# EAGLE design ccr_v10 (EAGLE 6.1)
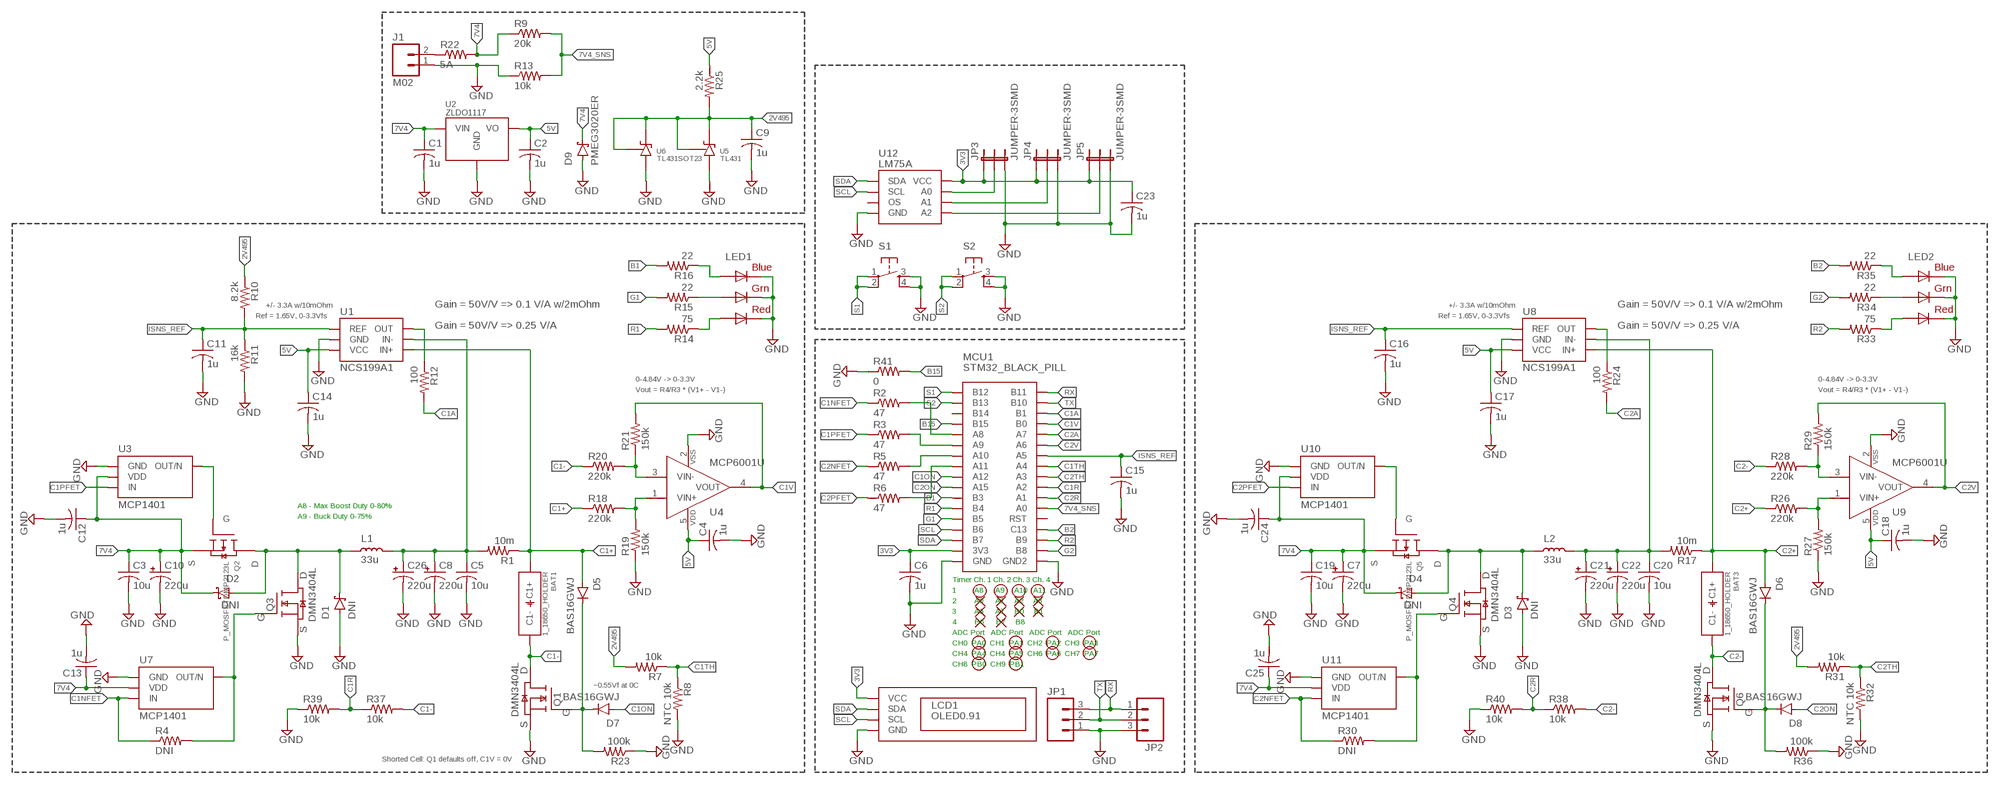
[diagram p0: schematic, sheet 1]

## Parts
BAT1  1_18650_HOLDER  [1S_18650_SMD_NH]
BAT3  1_18650_HOLDER  [1S_18650_SMD_NH]
C1  1u  C-USC0402  [C0402]
C2  1u  C-USC0402  [C0402]
C3  10u  C-USC1206  [C1206]
C4  1u  C-USC0402  [C0402]
C5  10u  C-USC1206  [C1206]
C6  1u  C-USC0402  [C0402]
C7  220u  CPOL-USD  [PANASONIC_D]
C8  220u  CPOL-USD  [PANASONIC_D]
C9  1u  C-USC0402  [C0402]
C10  220u  CPOL-USD  [PANASONIC_D]
C11  1u  C-USC0402  [C0402]
C12  1u  C-USC0402  [C0402]
C13  1u  C-USC0402  [C0402]
C14  1u  C-USC0402  [C0402]
C15  1u  C-USC0402  [C0402]
C16  1u  C-USC0402  [C0402]
C17  1u  C-USC0402  [C0402]
C18  1u  C-USC0402  [C0402]
C19  10u  C-USC1206  [C1206]
C20  10u  C-USC1206  [C1206]
C21  220u  CPOL-USD  [PANASONIC_D]
C22  220u  CPOL-USD  [PANASONIC_D]
C23  1u  C-USC0402  [C0402]
C24  1u  C-USC0402  [C0402]
C25  1u  C-USC0402  [C0402]
C26  220u  CPOL-USD  [PANASONIC_D]
D1  DNI  PMEG3020ER  [SOD123W]
D2  DNI  PMEG3020ER  [SOD123W]
D3  DNI  PMEG3020ER  [SOD123W]
D4  DNI  PMEG3020ER  [SOD123W]
D5  BAS16GWJ  BAT60A  [SOD323]
D6  BAS16GWJ  BAT60A  [SOD323]
D7  BAS16GWJ  BAT60A  [SOD323]
D8  BAS16GWJ  BAT60A  [SOD323]
D9  PMEG3020ER  [SOD123W]
J1  M02  [PHOENIXCONTACT1935161]
JP1  M03PTH  [1X03]
JP2  M03PTH  [1X03]
JP3  JUMPER-3SMD  [SJ_3]
JP4  JUMPER-3SMD  [SJ_3]
JP5  JUMPER-3SMD  [SJ_3]
L1  33u  SDR1307  [INDUCTOR_SMD_13MM]
L2  33u  SDR1307  [INDUCTOR_SMD_13MM]
LCD1  OLED0.91  [OLED0.91]
LED1  RGBLED5050  [RGBLED5050]
LED2  RGBLED5050  [RGBLED5050]
MCU1  STM32_BLACK_PILL  [STM32_BLACK_PILL_BOT]
Q1  DMN3404L  [SOT23]
Q2  P_MOSFETDMP2123L  [SOT23]
Q3  DMN3404L  [SOT23]
Q4  DMN3404L  [SOT23]
Q5  P_MOSFETDMP2123L  [SOT23]
Q6  DMN3404L  [SOT23]
R1  10m  R-US_R2512  [R2512]
R2  47  R-US_R0402  [R0402]
R3  47  R-US_R0402  [R0402]
R4  DNI  R-US_R0402  [R0402]
R5  47  R-US_R0402  [R0402]
R6  47  R-US_R0402  [R0402]
R7  10k  R-US_R0402  [R0402]
R8  NTC 10k  R-US_R0402  [R0402]
R9  20k  R-US_R0402  [R0402]
R10  8.2k  R-US_R0402  [R0402]
R11  16k  R-US_R0402  [R0402]
R12  100  R-US_R0402  [R0402]
R13  10k  R-US_R0402  [R0402]
R14  75  R-US_R0402  [R0402]
R15  22  R-US_R0402  [R0402]
R16  22  R-US_R0402  [R0402]
R17  10m  R-US_R2512  [R2512]
R18  220k  R-US_R0402  [R0402]
R19  150k  R-US_R0402  [R0402]
R20  220k  R-US_R0402  [R0402]
R21  150k  R-US_R0402  [R0402]
R22  5A  R-US_R1206  [R1206]
R23  100k  R-US_R0402  [R0402]
R24  100  R-US_R0402  [R0402]
R25  2.2k  R-US_R0402  [R0402]
R26  220k  R-US_R0402  [R0402]
R27  150k  R-US_R0402  [R0402]
R28  220k  R-US_R0402  [R0402]
R29  150k  R-US_R0402  [R0402]
R30  DNI  R-US_R0402  [R0402]
R31  10k  R-US_R0402  [R0402]
R32  NTC 10k  R-US_R0402  [R0402]
R33  75  R-US_R0402  [R0402]
R34  22  R-US_R0402  [R0402]
R35  22  R-US_R0402  [R0402]
R36  100k  R-US_R0402  [R0402]
R37  10k  R-US_R0402  [R0402]
R38  10k  R-US_R0402  [R0402]
R39  10k  R-US_R0402  [R0402]
R40  10k  R-US_R0402  [R0402]
R41  0  R-US_R0402  [R0402]
S1  TAC_SWITCHSMD  [TACTILE_SWITCH_SMD]
S2  TAC_SWITCHSMD  [TACTILE_SWITCH_SMD]
U1  NCS199A1  INA214  [SOT-363]
U2  ZLDO1117  [TO-261]
U3  MCP1401  [SOT23-5]
U4  MCP6001U  [SOT23-5]
U5  TL431  [SOT23-5]
U6  TL431SOT23  [SOT23]
U7  MCP1401  [SOT23-5]
U8  NCS199A1  INA214  [SOT-363]
U9  MCP6001U  [SOT23-5]
U10  MCP1401  [SOT23-5]
U11  MCP1401  [SOT23-5]
U12  LM75A  [8-SOIC]

## Nets
2V495: C9.1 R7.2 R10.1 R25.2 R31.2 U5.3(K) U5.4(REF) U6.1(K) U6.2(REF)
3V3: C6.1 C23.1 JP3.1 JP4.1 JP5.1 LCD1.2-VCC(VCC) MCU1.3V3 U12.8(VCC)
5V: C2.1 C4.1 C14.1 C17.1 C18.1 R25.1 U1.3(VCC) U2.2(VO) U2.4(VO) U4.5(VDD) U8.3(VCC) U9.5(VDD)
7V4: C1.1 C3.1 C7.+ C10.+ C12.1 C13.1 C19.1 C24.1 C25.1 D2.K(CATHODE) D4.K(CATHODE) D9.K(CATHODE) Q2.2(S) Q5.2(S) R9.1 R22.2 U2.3(VIN) U3.2(VDD) U7.2(VDD) U10.2(VDD) U11.2(VDD)
7V4_SNS: MCU1.A0 R9.2 R13.2
B1: MCU1.B3 R16.2
B2: MCU1.C13 R35.2
B15: MCU1.B15 R41.2
C1+: BAT1.1+(C1+) D5.A(ANODE) R1.1 R18.1 U1.4(IN+)
C1-: BAT1.1-(C1-) Q1.3(D) R20.1 R37.2
C1A: MCU1.B1 R12.2
C1NFET: R2.1 R4.1 U7.3(IN)
C1ON: D7.A(ANODE) MCU1.A12
C1PFET: R3.1 U3.3(IN)
C1R: MCU1.A2 R37.1 R39.2
C1TH: MCU1.A4 R7.1 R8.1
C1V: MCU1.B0 R21.2 U4.4(VOUT)
C2+: BAT3.1+(C1+) D6.A(ANODE) R17.1 R26.1 U8.4(IN+)
C2-: BAT3.1-(C1-) Q6.3(D) R28.1 R38.2
C2A: MCU1.A7 R24.2
C2NFET: R5.1 R30.1 U11.3(IN)
C2ON: D8.A(ANODE) MCU1.A15
C2PFET: R6.1 U10.3(IN)
C2R: MCU1.A1 R38.1 R40.2
C2TH: MCU1.A3 R31.1 R32.1
C2V: MCU1.A6 R29.2 U9.4(VOUT)
G1: MCU1.B5 R15.2
G2: MCU1.B8 R34.2
GND: C1.2 C2.2 C3.2 C4.2 C5.2 C6.2 C7.- C8.- C9.2 C10.- C11.2 C12.2 C13.2 C14.2 C15.2 C16.2 C17.2 C18.2 C19.2 C20.2 C21.- C22.- C23.2 C24.2 C25.2 C26.- D1.A(ANODE) D3.A(ANODE) D9.A(ANODE) J1.1 JP1.1 JP2.3 JP3.3 JP4.3 JP5.3 LCD1.1=GND(GND) LED1.4(BLUE_C) LED1.5(RED_C) LED1.6(GREEN_C) LED2.4(BLUE_C) LED2.5(RED_C) LED2.6(GREEN_C) MCU1.GND1(GND) MCU1.GND2 Q1.2(S) Q3.2(S) Q4.2(S) Q6.2(S) R8.2 R11.2 R13.1 R19.1 R23.1 R27.1 R32.2 R36.1 R39.1 R40.1 R41.1 S1.3 S1.4 S2.3 S2.4 U1.2(GND) U2.1(GND) U3.1(GND) U3.4(GND) U4.2(VSS) U5.2(A) U5.5(A) U6.3(A) U7.1(GND) U7.4(GND) U8.2(GND) U9.2(VSS) U10.1(GND) U10.4(GND) U11.1(GND) U11.4(GND) U12.4(GND)
I1-: C5.1 C8.+ C26.+ L1.2 R1.2 U1.5(IN-)
I1-1: C20.1 C21.+ C22.+ L2.2 R17.2 U8.5(IN-)
IS1O: R12.1 U1.6(OUT)
IS1O1: R24.1 U8.6(OUT)
ISNS_REF: C11.1 C15.1 C16.1 MCU1.A5 R10.2 R11.1 U1.1(REF) U8.1(REF)
N$1: MCU1.A8 R2.2
N$2: MCU1.A9 R3.2
N$3: R18.2 R19.2 U4.1(VIN+)
N$4: R20.2 R21.1 U4.3(VIN-)
N$5: Q2.1(G) U3.5(OUT/N)
N$6: D1.K(CATHODE) D2.A(ANODE) L1.1 Q2.3(D) Q3.3(D)
N$7: Q3.1(G) R4.2 U7.5(OUT/N)
N$8: MCU1.A10 R5.2
N$9: MCU1.A11 R6.2
N$10: LED1.3(BLUE_A) R16.1
N$11: LED1.1(GREEN_A) R15.1
N$12: LED1.2(RED_A) R14.1
N$13: J1.2 R22.1
N$14: D5.K(CATHODE) D7.K(CATHODE) Q1.1(G) R23.2
N$15: D6.K(CATHODE) D8.K(CATHODE) Q6.1(G) R36.2
N$16: R26.2 R27.2 U9.1(VIN+)
N$17: R28.2 R29.1 U9.3(VIN-)
N$18: D3.K(CATHODE) D4.A(ANODE) L2.1 Q4.3(D) Q5.3(D)
N$19: Q5.1(G) U10.5(OUT/N)
N$20: Q4.1(G) R30.2 U11.5(OUT/N)
N$21: LED2.3(BLUE_A) R35.1
N$22: LED2.1(GREEN_A) R34.1
N$23: LED2.2(RED_A) R33.1
N$27: JP3.2 U12.7(A0)
N$28: JP4.2 U12.6(A1)
N$29: JP5.2 U12.5(A2)
R1: MCU1.B4 R14.2
R2: MCU1.B9 R33.2
RX: JP1.3 JP2.1 MCU1.B11
S1: MCU1.B12 S1.1 S1.2
S2: MCU1.B13 S2.1 S2.2
SCL: LCD1.3=SCL(SCL) MCU1.B6 U12.2(SCL)
SDA: LCD1.4-SDA(SDA) MCU1.B7 U12.1(SDA)
TX: JP1.2 JP2.2 MCU1.B10
Unconnected: MCU1.B14 MCU1.RST U12.3(OS)

## Notes on the sheet
- +/- 3.3A w/10mOhm | Gain = 50V/V => 0.1 V/A w/2mOhm | +/- 3.3A w/10mOhm | Gain = 50V/V => 0.1 V/A w/2mOhm
- Ref = 1.65V, 0-3.3Vfs | Ref = 1.65V, 0-3.3Vfs
- Gain = 50V/V => 0.25 V/A | Gain = 50V/V => 0.25 V/A
- 0-4.84V -> 0-3.3V | 0-4.84V -> 0-3.3V
- Vout = R4/R3 * (V1+ - V1-) | Vout = R4/R3 * (V1+ - V1-)
- A8 - Max Boost Duty 0-80%
- A9 - Buck Duty 0-75%
- Timer Ch. 1 Ch. 2 Ch. 3 Ch. 4
- 1         A8      A9     A10   A11
- 2         A0      A1     A2     A3
- 3         A6      A7     B0     B1
- 4         B6      B7     B8
- ADC Port   ADC Port   ADC Port   ADC Port
- CH0  PA0  CH1  PA1  CH2  PA2  CH3  PA3
- CH4  PA4  CH4  PA5  CH6  PA6  CH7  PA7
- CH8  PB0  CH9  PB1
- ~0.55Vf at 0C
- Shorted Cell: Q1 defaults off, C1V = 0V

## Library data of the parts
BAT1 BAT3 = custom:1_18650_HOLDER
C1-C6 C9 C11-C20 C23-C25 = resistor:C-US: CAPACITOR, American symbol
C7 C8 C10 C21 C22 C26 = resistor:CPOL-US: POLARIZED CAPACITOR, American symbol
D1-D4 D9 = custom:PMEG3020ER: Schottky Diode 30V 2A 0.42V 1.5mA Leakage
D5-D8 = custom:BAT60A: Schottky Diode 10V 3A 0.37V at 1A
J1 = custom:M02
JP1 JP2 = SparkFun:M03: Header 3 Standard 3-pin 0.1" header. Use with straight break away headers (SKU : PRT-00116), right angle break away headers (PRT-00553), swiss pins (PRT-00743), machine pins (PRT-00117), and female headers (PRT-00115). Molex polarized connector foot print use with SKU : PRT-08232 with associated crimp pins and housings.
JP3-JP5 = SparkFun:JUMPER-3
L1 L2 = custom:SDR1307
LCD1 = custom:OLED0.91
LED1 LED2 = adafruit:RGBLED: For 5050 RGB LEDs, the order of the LEDs may vary from one manufacturer to another!
MCU1 = custom:STM32_BLACK_PILL
Q1 Q3 Q4 Q6 = custom:DMN3404L: N-Channel MOSFET 30V 5.8A 28mOhm Logic Level
Q2 Q5 = custom:P_MOSFET
R1-R41 = resistor:R-US_: RESISTOR, American symbol
S1 S2 = SparkFun:TAC_SWITCH: Momentary Switch Button commonly used for reset or general input. Spark Fun Electronics SKU : COM-00097
U1 U8 = custom:INA214: Current Shunt Amplifier 30kHz 2.7-26V
U2 = custom:ZLDO1117: Linear Regulator 18V Max 1A 10mA
U3 U7 U10 U11 = custom:MCP1401: 500mA MOSFET gate driver 4.5-18V, 3V input. 1402 = Non-inverting, 1401 = Inverting
U4 U9 = custom:MCP6001: Op-Amp Single Rail-to-Rail 1MHz
U5 U6 = custom:TL431: Shunt Voltage Reference IC 700uA 100mA 36V
U12 = custom:LM75A: I2C Temperature Sensor -55 to 125 C 11b 8-SOIC

## Board
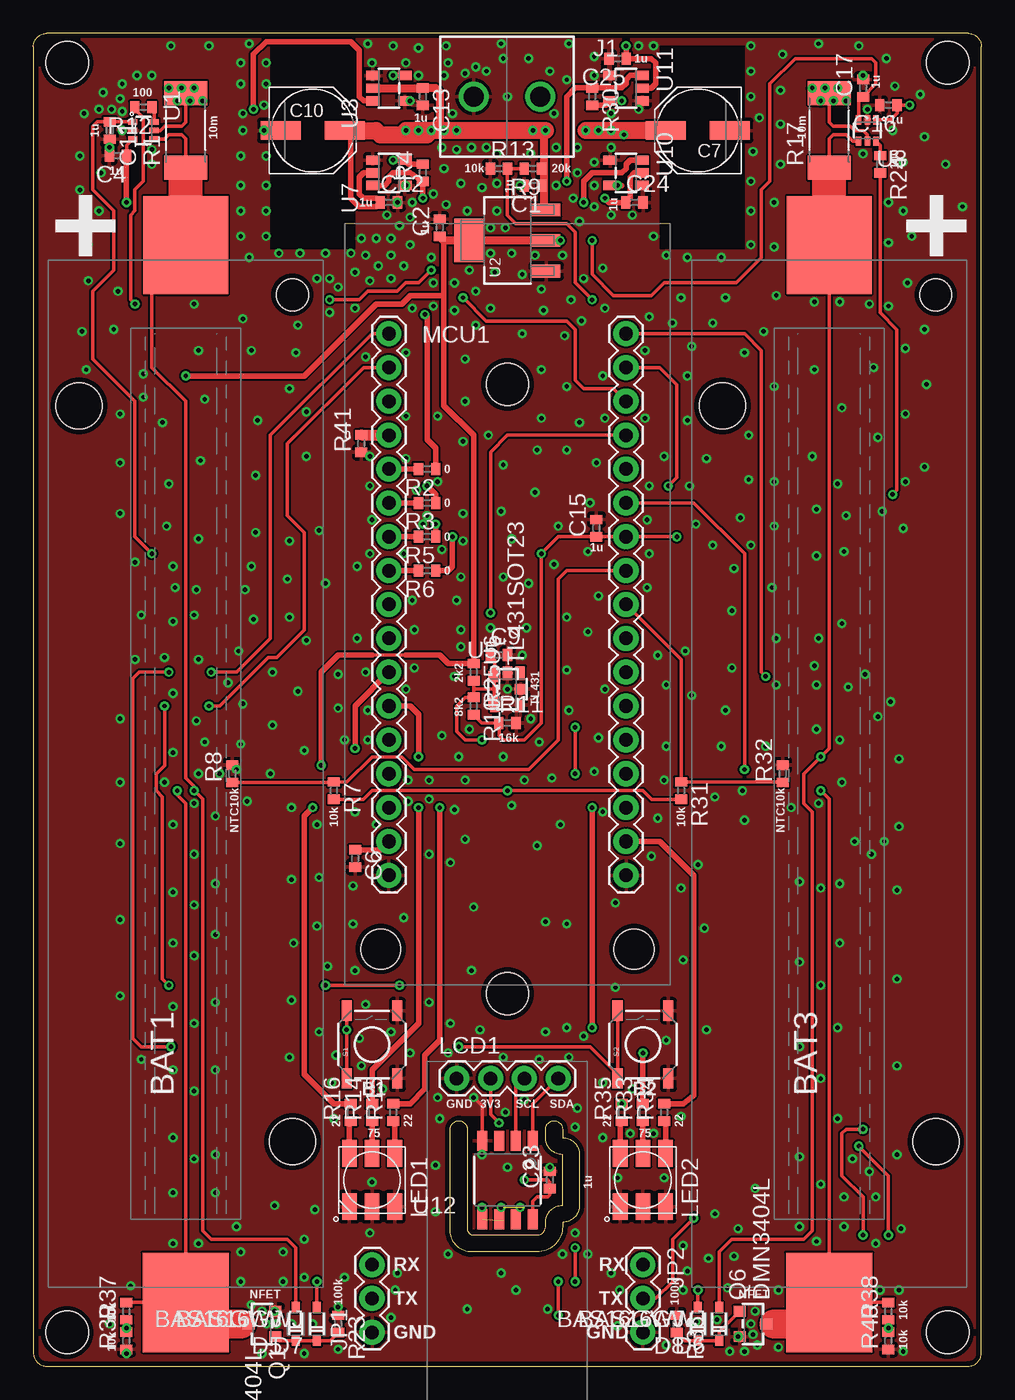
[diagram p1: board, top side]
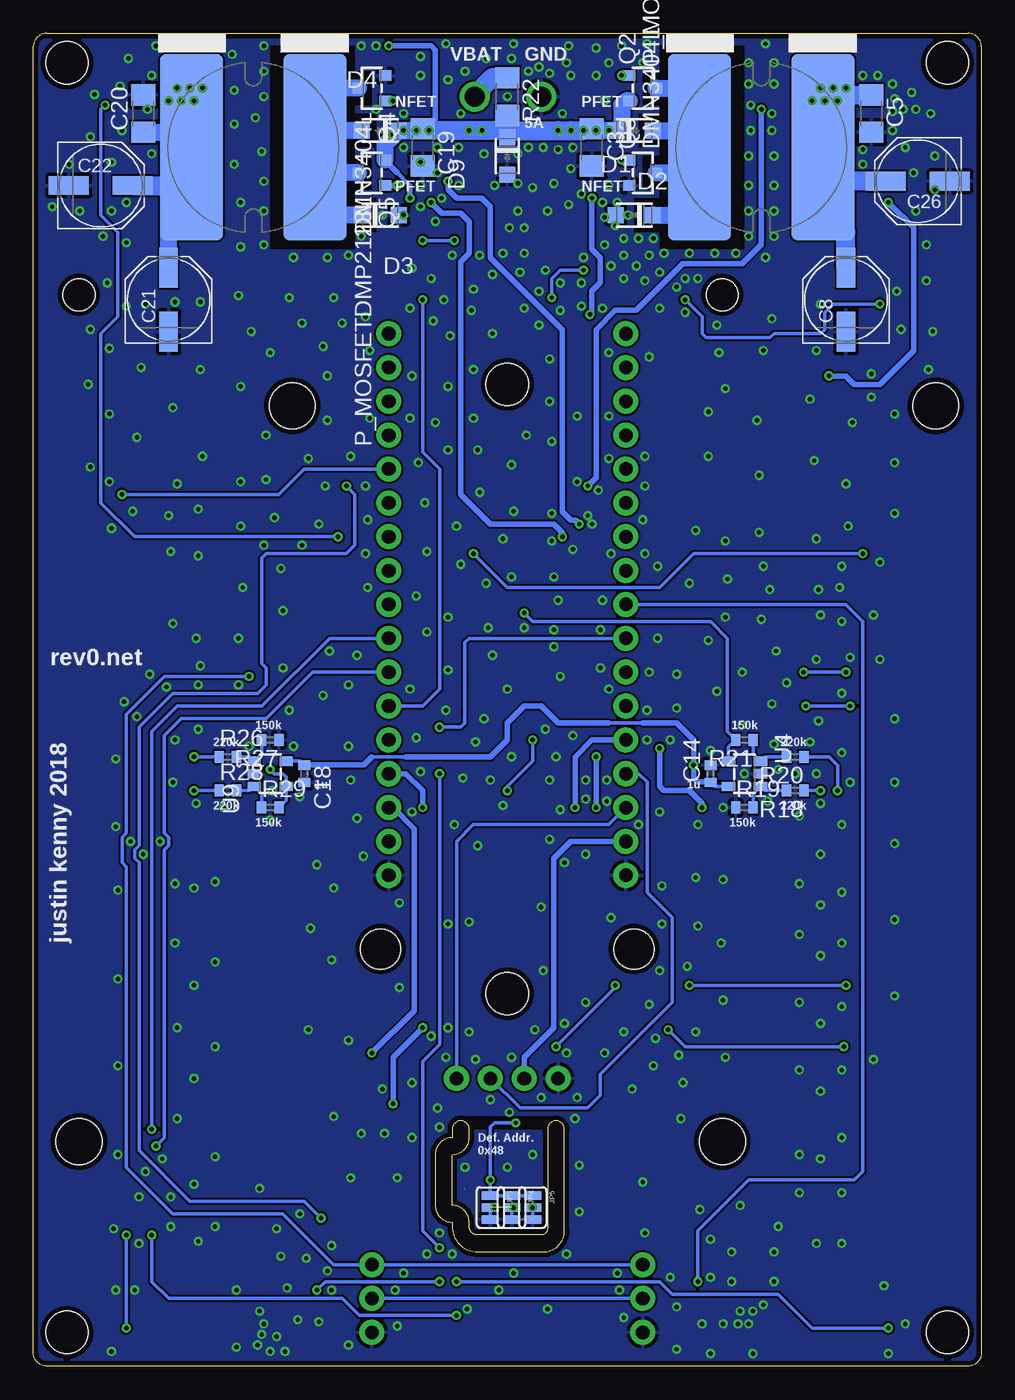
[diagram p2: board, bottom side, seen from below]

Size 71.11 x 100 mm. Coordinates in mm from the lower left corner, seen from the top.
Outline: 1,0 70.11,0 arc90 71.11,1 71.11,99 arc90 70.11,100 1,100 arc90 0,99 0,1 arc90 1,0
Outline: 32.54,17.78 32.54,10.32 arc90 33.02,9.84 37.78,9.84 arc90 38.42,10.48 38.42,10.79 arc-90 39.69,12.06 39.69,15.88 arc-90 38.42,17.14 38.42,17.78 arc-180 39.69,17.78 39.69,17.14 arc-90 40.96,15.88 40.96,12.06 arc-90 39.69,10.79 39.69,10.48 arc-90 37.78,8.57 32.86,8.57 arc-90 31.27,10.16 31.27,17.78 arc-180 32.54,17.78
Copper layers (1*16): Top 0.0356mm / dielectric 1.5011mm / Bottom 0.0356mm
Design rules: minimum track width 6mil, minimum drill 13mil, track to track 6mil, track to pad 6mil, pad to pad 6mil, via to via 6mil, smd to smd 6mil, copper to edge 15mil, drill to drill 6mil, minimum pad ring 7mil, minimum via ring 7mil, stop-mask expansion 2.5mil, vias tented up to drill 14mil, thermal gap 10mil
Holes 3.17 mm at 2.54,2.54 68.58,2.54 68.58,97.79 35.56,73.66 35.56,27.94 2.54,97.79
tRestrict: area 17.8,83.8 to 24.1,99.1; area 47,83.8 to 53.3,99.1; area 32.2,17.8 to 38.7,18.7
bRestrict: area 17.8,83.8 to 24.1,99.1; area 47,83.8 to 53.3,99.1; area 24.1,85.1 to 26,87.6; area 24.1,88.3 to 25.4,90.8; area 24.1,91.4 to 25.7,94; area 24.1,94.6 to 25.4,97.2; area 45.7,94.6 to 47,97.2; area 45.7,88.3 to 47,90.8; area 45.4,91.4 to 47,94; area 45.4,85.1 to 47,87.6; area 32.2,17.8 to 38.7,18.7

### Footprints (pad centres in the part's own frame; a part is rotated, then mirrored left to right if it is on the bottom)
1S_18650_SMD_NH = smd 7.341 x 6.35: 1+ 39.67,0 | smd 7.46 x 6.47: 1- -39.67,0 | hole 3.454: -27.6,-8; 27.6,8 | hole 2.39: 35.93,-8
C0402 = smd 0.7 x 0.9: 1 -0.65,0; 2 0.65,0
C1206 = smd 1.6 x 1.8: 1 -1.4,0; 2 1.4,0
PANASONIC_D = smd 3 x 1.4: + 2.4,0; - -2.4,0
SOD123W = smd 1.2 x 1.2: A -1.4,0; K 1.4,0
SOD323 = smd 0.6 x 0.8: A 0,-1.25; K 0,1.25
PHOENIXCONTACT1935161 = drill 1.5: 1 0,0; 2 5,0
1X03 = drill 1.016 pad 1.88: 1 0,0; 2 2.54,0; 3 5.08,0
SJ_3 = smd 0.635 x 1.27: 1 -0.889,0; 2 0,0; 3 0.889,0
INDUCTOR_SMD_13MM = smd 14 x 4.75: 1 0,4.625; 2 0,-4.625
OLED0.91 = drill 1.016 pad 1.88: 1=GND -3.81,0; 2-VCC -1.27,0; 3=SCL 1.27,0; 4-SDA 3.81,0
RGBLED5050 = smd 2 x 1.1: 1 -2,1.7; 2 -2,0; 3 -2,-1.7; 4 2,-1.7; 5 2,0; 6 2,1.7
STM32_BLACK_PILL_BOT = drill 1.016 pad 1.88: 3V3 -8.89,-19.05; A0 8.89,-8.89; A1 8.89,-6.35; A2 8.89,-3.81; A3 8.89,-1.27; A4 8.89,1.27; A5 8.89,3.81; A6 8.89,6.35; A7 8.89,8.89; A8 -8.89,8.89; A9 -8.89,6.35; A10 -8.89,3.81; A11 -8.89,1.27; A12 -8.89,-1.27; A15 -8.89,-3.81; B0 8.89,11.43; B1 8.89,13.97; B3 -8.89,-6.35; B4 -8.89,-8.89; B5 -8.89,-11.43; B6 -8.89,-13.97; B7 -8.89,-16.51; B8 8.89,-19.05; B9 8.89,-16.51; B10 8.89,16.51; B11 8.89,19.05; B12 -8.89,19.05; B13 -8.89,16.51; B14 -8.89,13.97; B15 -8.89,11.43; C13 8.89,-13.97; GND1 -8.89,-21.59; GND2 8.89,-21.59; RST 8.89,-11.43 | hole 3: -9.5,-27.12; 9.5,-27.12
SOT23 = smd 0.8 x 0.9: 1 0.95,1; 2 -0.95,1; 3 0,-1
R2512 = smd 1.8 x 3.2: 1 -2.8,0; 2 2.8,0
R0402 = smd 0.7 x 0.9: 1 -0.65,0; 2 0.65,0
R1206 = smd 1.6 x 1.803: 1 -1.422,0; 2 1.422,0
TACTILE_SWITCH_SMD = smd 1.524 x 0.762: 1 -2.54,1.905; 2 2.54,1.905; 3 -2.54,-1.905; 4 2.54,-1.905
SOT-363 = smd 0.42 x 0.7: 1 -0.65,-0.8; 2 0,-0.8; 3 0.65,-0.8; 4 0.65,0.8; 5 0,0.8; 6 -0.65,0.8
TO-261 = smd 0.95 x 2.15: 1 -2.3,-2.9; 2 0,-2.9; 3 2.3,-2.9 | smd 3.25 x 2.15: 4 0,2.9
SOT23-5 = smd 0.7 x 1: 1 0.95,1.2; 2 0,1.2; 3 -0.95,1.2; 4 -0.95,-1.2; 5 0.95,-1.2
8-SOIC = smd 0.75 x 1.5: 1 -1.905,-2.95; 2 -0.635,-2.95; 3 0.635,-2.95; 4 1.905,-2.95; 5 1.905,2.95; 6 0.635,2.95; 7 -0.635,2.95; 8 -1.905,2.95

### Placement (x,y rotation side)
BAT1  11.43,44.45 90 top
BAT3  59.69,44.45 90 top
C1  37.47,88.58 180 top
C2  30.48,85.41 90 top
C3  29.21,91.44 270 bottom
C4  6.35,90.81 180 top
C5  8.26,93.98 270 bottom
C6  24.13,38.1 270 top
C7  49.85,92.71 180 top
C8  10.16,80.01 90 bottom
C9  34.92,53.34 0 top
C10  20.95,92.71 0 top
C11  5.71,92.71 270 top
C12  26.67,87.31 0 top
C13  29.21,95.25 270 top
C14  20.32,44.45 90 bottom
C15  42.23,62.87 90 top
C16  64.14,94.61 180 top
C17  62.23,95.89 90 top
C18  50.8,44.45 270 bottom
C19  41.91,91.44 270 bottom
C20  62.87,93.98 90 bottom
C21  60.96,80.01 90 bottom
C22  66.04,88.58 0 bottom
C23  38.73,13.97 90 top
C24  45.09,87.31 0 top
C25  43.81,98.11 180 top
C26  4.76,88.9 180 bottom
D1  26.04,86.36 0 bottom
D2  26.04,92.71 180 bottom
D3  45.09,86.36 180 bottom
D4  45.09,92.71 0 bottom
D5  19.68,3.17 180 top
D6  51.44,3.17 180 top
D7  21.27,3.17 180 top
D8  49.85,3.17 180 top
D9  35.56,90.81 90 bottom
J1  33.02,95.25 0 top
JP1  25.4,2.54 90 top
JP2  45.72,7.62 270 top
JP3  36.83,11.91 270 bottom
JP4  35.24,11.91 270 bottom
JP5  33.66,11.91 270 bottom
L1  16.51,91.44 90 bottom
L2  54.61,91.44 270 bottom
LCD1  35.56,21.59 0 top
LED1  25.4,13.97 270 top
LED2  45.72,13.97 270 top
MCU1  35.56,58.42 0 top
Q1  17.14,3.17 270 top
Q2  25.4,95.89 90 bottom
Q3  25.4,89.53 90 bottom
Q4  45.72,95.89 270 bottom
Q5  45.72,89.53 270 bottom
Q6  53.98,3.17 90 top
R1  11.43,92.71 90 top
R2  29.53,67.31 180 top
R3  29.53,64.77 180 top
R4  29.21,89.53 90 top
R5  29.53,62.23 180 top
R6  29.53,59.69 180 top
R7  22.54,43.18 270 top
R8  14.92,44.45 90 top
R9  37.47,89.85 180 top
R10  33.02,49.53 270 top
R11  35.56,48.26 0 top
R12  8.26,94.46 180 top
R13  34.92,89.85 0 top
R14  25.4,19.05 90 top
R15  26.99,19.05 90 top
R16  23.81,19.05 90 top
R17  59.69,92.71 90 top
R18  13.97,43.18 180 bottom
R19  17.78,41.91 0 bottom
R20  13.97,45.72 180 bottom
R21  17.78,46.99 180 bottom
R22  35.56,95.25 270 bottom
R23  22.86,3.17 270 top
R24  63.5,90.17 270 top
R25  33.02,52.07 270 top
R26  56.52,45.72 0 bottom
R27  53.34,46.99 180 bottom
R28  56.52,43.18 0 bottom
R29  53.34,41.91 0 bottom
R30  41.91,95.25 270 top
R31  48.58,43.18 270 top
R32  56.2,44.45 90 top
R33  45.72,19.05 90 top
R34  47.31,19.05 90 top
R35  44.13,19.05 90 top
R36  48.26,3.17 270 top
R37  6.99,4.13 90 top
R38  64.14,4.13 90 top
R39  6.99,1.91 90 top
R40  64.14,1.91 90 top
R41  24.61,69.22 90 top
S1  25.4,24.13 90 top
S2  45.72,24.13 90 top
U1  8.26,92.71 270 top
U2  35.56,84.45 90 top
U3  26.67,95.89 90 top
U4  17.78,44.45 270 bottom
U5  35.56,50.8 0 top
U6  35.56,50.8 90 top
U7  26.67,89.53 90 top
U8  62.55,92.71 180 top
U9  53.34,44.45 90 bottom
U10  44.45,89.53 270 top
U11  44.45,95.89 270 top
U12  35.56,13.97 180 top

### Tracks (layer width: path | path; a pad name or v marks a point on that pad's centre or on a via)
2V495  (via drill 0.33)
  Top 0.254: U6.2 34.61,49.8 U5.4 34.56,49.65 34.56,50.8 | 33.02,50.8 R10.1 32.4,50.18 31.75,49.53 31.75,47.62 32.38,46.99 v33.66,46.99 | 34.56,50.8 U6.1 34.56,51.95 U5.3 34.61,53.01 C9.1 | R25.2 33.02,50.8 | 33.02,50.8 34.56,50.8 | R31.2 46.37,42.53 45.72,43.18 v35.56,43.18 25.4,43.18 24.75,42.53 R7.2
  Bottom 0.254: v33.66,46.99 33.66,45.4 35.56,43.5 v35.56,43.18
3V3  (via drill 0.33)  (1 unrouted)
  Top 0.254: v34.92,18.26 34.29,18.89 LCD1.2-VCC | v36.83,13.97 38.58,13.97 38.73,13.81 38.73,13.34 | C23.1 38.73,12.86 38.58,12.7 37.78,12.7 37.47,12.38 U12.8
  Top 0.406: C6.1 26.05,38.75 MCU1.3V3
  Bottom 0.254: JP4.1 35.24,12.86 | JP5.1 JP4.1 | JP4.1 36.73,12.79 36.83,12.7 36.92,12.79 JP3.1 v36.83,13.97 36.83,17.94 36.51,18.26 v34.92,18.26
  Bottom 0.406: LCD1.2-VCC 34.29,23.18 32.07,25.4 32.07,38.1 30.8,39.37 MCU1.3V3
5V  (via drill 0.33)
  Top 0.254: C4.1 7,91.61 U1.3 | 27.94,53.34 25.4,53.34 | U8.3 61.9,94.92 62.23,95.25 | 62.23,95.25 63.18,96.2 63.18,97.79 62.87,98.11 57.15,98.11 55.24,96.2 55.24,88.9 54.61,88.27 54.61,83.19 52.7,81.28 47.31,81.28 46.35,80.33 43.5,80.33 41.91,81.92 v41.91,84.45 | v39.53,84.45 U2.2 | C17.1 62.23,95.25
  Top 0.406: 27.94,53.34 30.48,53.34 31.1,52.72 R25.1 33.02,69.85 30.8,72.07 30.8,80.33 | 25.4,53.34 22.86,53.34 21.59,52.07 v21.59,45.09 | v6.99,87.31 6.99,90.79 C4.1 | 30.8,80.33 30.8,84.44 | 30.78,84.45 30.8,84.44 | 30.8,80.33 28.26,80.33 27.62,79.69 25.72,79.69 20.32,74.3 v11.43,74.3 | 30.8,84.44 32.65,84.44 U2.4
  Top 0.61: U2.2 U2.4 30.78,84.45 C2.1
  Bottom 0.254: U4.5 20.02,43.5 C14.1 | U9.5 51.1,45.4 C18.1 | 45.72,45.72 43.18,45.72 | 27.94,48.26 25.4,48.26 | v41.91,84.45 v39.53,84.45
  Bottom 0.406: C14.1 20.34,43.81 21.27,43.81 21.59,44.13 v21.59,45.09 21.59,46.99 22.86,48.26 25.4,48.26 | C18.1 46.34,45.1 45.72,45.72 | 43.18,45.72 36.83,45.72 35.56,46.99 35.56,48.26 34.29,49.53 33.02,49.53 31.75,48.26 27.94,48.26 | v6.99,87.31 5.08,85.41 5.08,76.2 7.62,73.66 9.53,73.66 10.16,74.3 v11.43,74.3
7V4  (via drill 0.33)
  Top 0.406: 25.72,95.89 25.72,95.9 | U7.2 24.77,89.53 24.45,89.22 24.45,87.95 24.77,87.63 25.72,87.63 26.04,87.31 C12.1 25.7,87 24.45,87 23.81,87.63 23.81,92.25 C10.+ | U11.2 46.35,95.89 46.67,96.2 46.67,97.79 46.35,98.11 C25.1 | C25.1 | C25.1 44.47,99.05 v44.45,99.06 | U10.2 45.09,89.53 44.77,89.22 44.77,87.64 C24.1 43.18,87.31 v42.86,87.63 | C13.1 29.21,95.89 | C1.1 38.26,88.58 38.26,88.47 38.3,88.42
  Top 0.61: U2.3 38.3,87 38.3,88.42 38.3,90.17 | U3.2 25.72,95.89 29.21,95.89 | C13.1 30.15,95.9 30.48,95.57 30.48,93.34 v29.84,92.71 | 44.45,98.12 C25.1 | 38.3,90.17 38.3,92.35 v38.42,92.71 | R9.1 38.14,89.85 38.3,90.17
  Top 1.27: v29.84,92.71 29.53,92.39 26.04,92.39 25.72,92.71 C10.+ | v41.43,92.71 v42.39,92.71 v43.34,92.71 C7.+ | v38.42,92.71 v37.47,92.71 v27.94,92.71
  Bottom 0: D9.K 35.56,92.71
  Bottom 0.254: Q5.2 44.45,90.48
  Bottom 0.305: 43.81,89.53 42.86,88.58
  Bottom 0.406: 26.67,95.2 Q2.2 | v44.45,99.06 41.27,99.06 40.96,98.74 40.96,93.03 v41.43,92.71 | v42.86,87.63 42.86,88.58 | Q5.2 44.72,90.44 43.81,89.53 | v44.29,92.39 43.5,92.39 v43.34,92.71
  Bottom 1.27: 29.08,92.71 v28.89,92.71 v27.94,92.71 D2.K 26.99,93.16 26.99,94.61 26.67,94.94 Q2.2 | v29.84,92.71 29.08,92.71 | 29.08,92.71 C3.1 | C19.1 42.1,92.84 v42.39,92.71 v43.34,92.71 | v43.34,92.71 D4.K 44.72,91.67 Q5.2 | v43.34,92.71 v41.43,92.71 40.56,92.71
  Bottom 1.422: 35.56,92.71 40.56,92.71 | R22.2 35.56,92.71 | 35.56,92.71 v31.75,92.71 v30.8,92.71 v29.84,92.71
7V4_SNS  (via drill 0.33)
  Top 0.254: v41.91,80.01 40.64,81.28 40.64,85.09 40.01,85.72 36.2,85.72 35.56,86.36 35.56,89.53 35.88,89.85 | 35.88,89.85 R9.2 | 35.88,89.85 R13.2
  Bottom 0.254: v41.91,80.01 41.91,68.58 40.64,67.31 40.64,50.8 41.91,49.53 MCU1.A0
B1  (via drill 0.33)
  Top 0.406: R16.2 22.54,19.68 20.32,21.91 20.32,41.27 v20.95,41.91 | v24.13,46.35 24.13,49.53 MCU1.B3
  Bottom 0.406: v20.95,41.91 20.95,42.23 21.91,43.18 23.81,43.18 24.13,43.5 v24.13,46.35
B2  (via drill 0.33)
  Top 0.406: v41.91,25.4 v41.91,41.91 | v44.13,19.68 R35.2
  Bottom 0.406: v41.91,41.91 41.91,43.18 43.18,44.45 MCU1.C13 | v41.91,25.4 44.13,23.18 v44.13,19.68
B15
  Top 0.813: R41.2 26.66,69.86 MCU1.B15
C1+  (via drill 0.33)
  Top 0.254: U1.4 9.83,92.06 10.16,92.39 11.11,92.39 11.43,92.08 R1.1 | D5.A 19.68,8.89 19.05,9.53 13.34,9.53 12.7,10.16 12.7,42.55 v12.06,43.18 12.06,43.5 11.43,44.13 11.43,72.39 8.89,74.93 8.89,81.58 BAT1.1+
  Top 1.778: R1.1 11.43,88.9
  Top 2.54: BAT1.1+ 11.43,88.9
  Bottom 0.254: v12.06,43.18 R18.1
C1-  (via drill 0.33)
  Top 0.254: v10.79,43.18 10.79,42.86 11.43,42.23 BAT1.1- R37.2
  Top 0.406: Q1.3 15.56,3.17
  Top 2.184: BAT1.1- 12.05,4.78 13.65,3.17 15.56,3.17
  Bottom 0.254: v10.79,43.18 10.79,45.09 11.43,45.72 R20.1
C1A  (via drill 0.33)
  Top 0.254: MCU1.B1 43.5,73.34 41.27,73.34 40.64,73.98 40.64,77.79 40.01,78.42 33.97,78.42 v32.23,80.17 | v29.84,82.23 28.89,81.28 27.94,81.28 27.3,80.64 25.08,80.64 24.45,80.01 v22.23,80.01 | v7.62,79.69 7.3,80.01 7.3,86.36 7.62,86.68 7.62,88.27 8.26,88.9 8.26,93.66 7.61,94.31 R12.2
  Bottom 0.254: v32.23,80.17 32.23,81.6 31.59,82.23 v29.84,82.23 | v22.23,80.01 20.95,78.74 20.95,77.47 20.64,77.15 15.88,77.15 15.56,77.47 12.06,77.47 11.75,77.79 11.75,79.06 11.11,79.69 v7.62,79.69
C1NFET  (via drill 0.33)
  Top 0.406: R2.1 30.18,68.88 29.53,69.53 29.53,78.74 v29.37,78.9 | v29.21,87.63 R4.1 28.26,89.53 26.99,89.53 26.67,89.22 26.67,88.9 26.36,88.58 U7.3
  Bottom 0.406: v29.37,78.9 29.21,79.06 29.21,80.64 28.57,81.28 28.57,83.19 29.21,83.82 v29.21,87.63
C1ON  (via drill 0.33)
  Top 0.254: v21.27,6.35 D7.A
  Bottom 0.254: MCU1.A12 10.16,57.15 8.89,55.88 8.89,14.61 9.53,13.97 17.46,13.97 21.27,10.16 v21.27,6.35
C1PFET  (via drill 0.33)
  Top 0.406: R3.1 30.18,65.39 v29.53,66.04 | v16.51,94.3 16.51,98.42 17.46,99.38 23.81,99.38 24.45,98.74 24.45,95.25 24.77,94.93 U3.3
  Bottom 0.406: v29.53,66.04 28.89,66.67 28.89,77.79 27.46,79.22 25.88,79.22 22.38,82.71 17.94,82.71 16.51,84.14 v16.51,94.3
C1R  (via drill 0.33)
  Top 0.254: R39.2 v6.99,2.86 R37.1 | v39.37,6.35 v39.37,3.81 | v62.23,9.84 62.23,12.7 60.64,14.29 60.64,17.46 60.96,17.78 v62.23,17.78
  Bottom 0.254: MCU1.A2 48.9,54.61 53.98,49.53 60.33,49.53 62.23,47.62 v62.23,17.78 | v6.99,2.86 12.7,2.86 15.24,5.4 23.18,5.4 24.13,6.35 v39.37,6.35 | v39.37,3.81 46.67,3.81 47.94,5.08 60.96,5.08 62.23,6.35 v62.23,9.84
C1TH
  Top 0.254: R8.1 22.51,43.8 R7.1 23.51,43.83 25.4,45.72 27.62,45.72 28.57,44.77 37.15,44.77 39.37,46.99 39.37,59.05 40.01,59.69 MCU1.A4
C1V  (via drill 0.33)
  Top 0.254: MCU1.B0 35.56,69.85 34.29,68.58 v34.29,56.52
  Bottom 0.254: U4.4 18.98,46.44 R21.2 19.05,47.61 19.05,54.61 20.32,55.88 33.66,55.88 v34.29,56.52
C2+  (via drill 0.33)
  Top 0.254: BAT3.1+ 59.69,46.35 v59.05,45.72 57.78,44.45 57.78,42.23 58.42,41.59 58.42,10.16 57.78,9.53 52.39,9.53 51.44,8.57 D6.A | U8.4 61.44,91.91 60.96,92.39 60.01,92.39 59.69,92.08 R17.1
  Top 0.406: R17.1 59.69,89.53
  Top 2.54: BAT3.1+ 59.69,89.53
  Bottom 0.254: v59.05,45.72 R26.1
C2-  (via drill 0.33)
  Top 0.254: v59.05,43.18 59.69,42.55 BAT3.1- R38.2
  Top 0.406: Q6.3 55.56,3.17
  Top 2.184: 55.56,3.17 58.09,3.17 BAT3.1-
  Bottom 0.254: v59.05,43.18 R28.1
C2A  (via drill 0.33)
  Top 0.254: R24.2 63.5,79.06 64.77,77.79 64.77,65.72 v64.45,65.41
  Bottom 0.254: v64.45,65.41 52.7,65.41 50.8,67.31 MCU1.A7
C2NFET  (via drill 0.33)
  Top 0.254: 30.18,63.17 v30.16,63.18
  Top 0.406: 30.18,63.17 R5.1 | U11.3 44.77,96.84 44.45,96.52 44.45,96.2 44.15,95.9 R30.1 40.66,95.9 40.01,95.25 v40.01,88.9 | 45.72,96.84 U11.3 | U11.3
  Bottom 0.406: v30.16,63.18 30.48,63.5 30.8,63.5 31.43,64.14 31.43,77.79 36.83,83.19 36.83,87 37.47,87.63 39.37,87.63 40.01,88.27 v40.01,88.9
C2ON  (via drill 0.33)
  Top 0.254: v40.64,47.94 v40.64,44.45 | v40.64,8.89 v40.64,6.35 | v49.85,5.71 D8.A
  Bottom 0.254: MCU1.A15 38.42,54.61 38.73,54.29 38.73,48.26 39.05,47.94 v40.64,47.94 | v40.64,6.35 49.21,6.35 v49.85,5.71 | v40.64,44.45 40.64,24.13 41.91,22.86 41.91,10.16 v40.64,8.89
C2PFET  (via drill 0.33)
  Top 0.406: R6.1 31.11,59.69 31.43,60.01 v31.43,62.23 | v41.27,87.31 41.27,88.9 41.91,89.53 44.13,89.53 44.45,89.85 44.45,90.17 44.77,90.49 U10.3
  Bottom 0.406: v31.43,62.23 31.43,62.55 32.07,63.18 36.83,63.18 39.05,65.41 39.05,82.87 38.42,83.5 38.42,85.88 39.05,86.52 40.48,86.52 v41.27,87.31
C2R  (via drill 0.33)
  Top 0.254: R40.2 v64.14,2.86 R38.1 | v61.91,16.51 64.14,14.29 v64.14,9.84
  Bottom 0.254: MCU1.A1 50.16,52.07 53.66,48.58 60.01,48.58 61.28,47.31 61.28,40.01 60.96,39.69 60.96,39.05 61.28,38.73 61.28,17.14 v61.91,16.51 | v64.14,2.86 v64.14,9.84
C2TH
  Top 0.254: R32.1 56.17,43.83 R31.1 48.58,53.02 MCU1.A3
C2V  (via drill 0.33)
  Top 0.254: v53.34,44.77 53.34,60.96 49.53,64.77 MCU1.A6
  Bottom 0.254: R29.2 52.14,42.46 U9.4 52.14,44.2 52.39,44.45 53.02,44.45 v53.34,44.77
G1  (via drill 0.33)
  Top 0.406: R15.2 28.26,19.68 29.37,20.8 29.37,23.34 30.48,24.45 v30.48,41.91
  Bottom 0.406: v30.48,41.91 30.48,45.72 29.21,46.99 MCU1.B5
G2
  Top 0.406: R34.2 48.74,19.68 49.53,20.32 49.53,36.83 46.99,39.37 MCU1.B8
GND  (via drill 0.33)
  Top 0.254: U12.4 33.66,19.53 v33.02,20.16
  other vias: 36.51,88.58 27.94,88.58 45.4,94.3 62.23,96.84 62.55,94.3 28.26,94.93 29.84,83.19 30,81.28 28.26,84.14 24.13,82.07 24.13,79.38 22.23,79.06 21.27,81.6 22.86,80.96 18.41,83.5 20,83.5 21.91,83.5 23.81,83.5 17.46,84.77 17.46,86.68 17.46,88.58 17.46,90.81 17.3,94.61 17.46,96.2 17.46,97.79 15.56,97.79 15.56,96.2 15.72,93.98 15.56,90.81 15.56,88.58 15.56,86.68 15.56,84.77 16.19,83.19 12.06,79.69 8.89,96.84 8.89,90.17 6.67,92.71 5.71,91.44 5.08,89.53 6.35,80.64 4.13,81.44 3.49,88.27 3.49,90.81 3.81,93.98 4.92,86.68 4.13,84.14 3.65,77.63 6.03,77.79 15.56,46.67 17.78,44.45 15.24,44.77 13.97,44.45 12.38,44.45 12.06,42.23 12.06,38.42 12.06,34.61 12.06,30.8 12.06,25.72 12.06,20.64 12.06,15.56 12.38,9.21 15.56,8.57 15.56,6.35 18.73,6.35 18.73,8.57 20.32,6.67 20.32,9.53 18.1,12.06 13.65,13.02 15.24,10.48 17.14,4.13 17.46,3.17 18.1,4.13 19.37,3.17 20.95,3.17 22.86,4.45 22.86,1.27 20.32,0.95 17.14,0.95 6.99,0.95 5.71,3.17 7.3,6.03 10.48,9.21 10.48,13.02 10.48,17.14 10.48,22.23 10.48,26.99 10.48,31.75 10.48,35.56 10.48,40.64 10.48,46.04 9.84,43.81 13.65,41.27 13.65,36.2 13.65,32.38 13.65,27.3 13.65,22.23 13.65,15.88 16.19,99.22 25.08,99.22 25.4,97.79 27.94,97.79 28.89,96.84 30.8,96.84 35.56,95.25 33.97,97.16 35.24,98.11 37.15,98.11 38.73,97.16 39.05,93.98 31.43,93.98 43.34,93.98 42.07,96.84 42.07,98.27 40.16,99.22 40.01,96.52 45.4,99.06 46.51,99.06 53.82,99.06 53.82,97.16 53.82,95.25 54.45,93.66 53.98,91.12 53.82,88.9 53.82,86.68 53.82,84.14 51.59,83.19 49.05,83.19 47.47,83.34 46.51,84.77 44.93,86.36 42.07,87 42.07,88.58 40.96,85.88 40.48,87.63 42.07,90.33 43.34,91.44 40.8,91.44 39.21,91.44 39.21,88.58 37.31,90.96 34.77,90.96 30.64,91.44 32.86,91.44 34.77,88.74 34.77,86.68 35.4,85.41 39.69,83.34 37.62,83.34 35.88,83.5 32.7,82.23 34.29,83.5 34.29,85.41 32.54,86.68 30.96,87.15 28.42,87.31 30,79.53 31.59,79.22 31.59,81.28 33.18,80.64 34.61,82.07 36.67,81.92 34.29,79.38 33.18,78.11 38.26,79.22 38.1,80.8 36.67,77.47 40.32,80.01 41.12,78.42 39.85,77.31 38.1,74.77 38.1,71.12 40.01,73.5 42.7,74.3 42.86,79.38 41.27,81.6 42.7,82.39 46.2,78.74 15.72,92.71 17.3,92.71 8.89,91.28 5.87,94.3 56.04,95.73 56.04,93.19 56.04,90.17 55.56,87.31 55.56,83.98 56.2,98.42 58.9,99.22 61.91,99.06 63.98,98.11 64.61,96.04 66.52,95.41 66.83,92.23 64.45,92.71 65.25,90.33 65.25,86.68 68.42,90.17 69.69,87 67.63,86.68 65.88,84.77 64.14,84.3 64.14,87.31 64.14,79.53 62.71,79.69 60.48,79.85 58.58,79.85 55.72,80.33 48.58,80.17 51.91,80.17 47.94,78.26 50.96,78.26 54.77,77.63 55.56,73.5 58.58,74.77 60.64,71.91 58.42,68.26 60.33,66.2 58.74,64.29 12.22,48.42 10.48,50.48 12.38,53.02 10.48,55.88 12.06,56.36 12.22,58.26 10.64,58.42 12.38,62.07 10,63.02 10.16,66.2 12.54,67.94 9.68,70.8 12.86,72.55 16.35,60.01 19.21,61.91 21.91,58.74 24.29,60.01 19.21,56.2 20.48,54.45 24.29,54.61 28.57,55.24 32.07,55.24 32.07,53.98 28.57,52.39 24.92,52.07 22.86,49.37 25.08,49.21 27.94,50.8 25.08,46.99 23.34,46.99 20.32,46.2 17.94,48.1 19.84,50.64 17.94,52.07 22.86,51.91 31.59,51.75 35.56,50.8 36.67,53.34 37.31,48.58 32.7,47.78 30.64,47.31 31.91,45.72 32.38,43.97 36.83,43.97 35.24,45.72 37.94,46.83 38.89,44.13 42.07,44.61 42.39,47.15 40.16,49.21 42.86,50.8 36.99,55.4 8.26,74.45 3.97,74.77 8.26,72.71 6.51,71.44 6.51,67.79 6.51,63.98 7.62,60.33 10.48,60.01 8.1,56.36 7.62,53.02 9.84,53.18 14.61,51.28 15.4,53.66 16.51,56.04 15.88,58.26 19.05,59.05 21.43,62.71 16.67,62.55 15.72,49.69 12.86,46.83 6.51,48.58 12.38,76.2 16.35,76.2 19.68,76.04 19.84,78.11 15.72,78.58 10.32,99.06 13.18,99.06 62.23,90.96 65.56,81.28 66.83,77.79 66.99,73.66 65.41,76.36 65.41,71.44 66.83,67.47 65.41,66.36 63.02,74.93 63.34,69.69 55.56,66.36 53.34,76.04 45.88,76.2 49.05,74.3 49.37,76.52 49.05,70.96 53.66,69.85 53.66,66.52 50.48,68.1 47.31,68.26 45.88,71.12 42.86,71.12 40.96,70.8 40.01,68.74 42.23,67.79 41.75,64.77 37.78,68.74 35.24,67.63 35.08,64.14 37.62,65.56 32.38,75.56 32.38,72.39 34.13,69.85 30.32,71.28 27.94,76.04 27.94,71.28 28.73,65.72 27.94,68.1 29.53,63.82 32.23,63.98 32.23,69.37 32.23,61.91 30.64,61.28 27.78,60.96 28.42,57.47 31.75,57.47 32.07,59.21 35.24,59.21 34.29,55.4 37.15,58.74 35.88,62.07 39.37,63.02 41.59,61.12 46.04,63.5 46.2,66.04 39.05,60.17 42.39,57.78 41.59,55.09 40.01,56.2 40.01,52.23 47.47,51.12 46.83,53.34 48.9,53.66 52.39,52.39 52.55,59.85 52.39,56.67 46.04,58.42 46.2,60.96 31.59,41.75 29.69,38.42 29.69,42.55 29.69,43.97 28.1,43.97 28.1,42.39 25.72,40.64 24.13,41.59 35.88,42.07 39.53,40.64 37.78,39.05 32.38,39.53 43.66,34.77 46.35,38.26 46.83,41.12 51.12,42.7 51.59,46.51 54.93,46.51 58.74,47.78 58.58,52.55 61.12,50.96 58.74,51.12 55.72,51.12 51.91,49.21 49.37,50.32 60.48,46.99 63.34,48.74 64.29,49.85 62.39,51.91 64.93,45.56 60.64,43.81 58.9,42.23 56.83,41.91 53.18,43.18 53.34,40.96 49.85,37.62 48.58,35.88 50.32,32.86 48.74,30.48 55.56,63.02 53.02,63.66 49.21,66.04 49.69,63.18 50.96,61.59 53.82,61.59 55.4,58.42 58.74,60.8 58.9,54.61 55.72,54.61 60.8,61.12 60.96,63.82 63.66,64.14 65.25,62.87 60.64,55.72 64.93,40.48 64.77,35.72 64.77,29.05 64.77,22.54 64.77,15.88 60.48,36.2 60.48,31.75 60.33,25.4 60.33,18.57 59.05,35.88 59.05,28.57 59.05,21.59 59.05,13.65 57.47,36.35 57.47,30.32 57.47,23.97 57.47,15.72 54.13,13.34 47.31,14.13 43.81,14.13 43.66,28.42 47.47,24.45 38.42,33.34 33.02,34.45 32.86,29.69 33.5,25.24 38.42,25.08 40.16,23.18 40.8,19.37 42.7,17.14 38.73,14.92 41.59,8.41 49.05,7.14 48.74,9.05 51.12,11.43 52.86,10.32 57.47,10.48 58.74,9.37 60.8,10.48 60.8,12.7 61.44,15.56 62.71,14.61 63.18,12.7 63.18,9.21 64.93,5.71 65.09,10.32 63.5,5.71 55.88,5.71 53.82,3.17 52.07,5.87 52.55,8.26 50.64,8.1 47.47,1.59 49.69,3.33 51.28,3.49 52.23,1.11 55.88,1.43 65.25,1.11 43.81,3.02 43.97,5.71 48.74,5.71 43.34,6.99 27.3,6.99 27.15,5.71 26.83,3.65 38.58,4.29 36.2,5.71 35.08,6.99 31.11,8.41 25.24,10 23.34,6.67 21.11,11.75 25.4,13.81 22.54,18.57 22.38,21.27 31.11,23.5 30.32,20.16 36.83,20 37.94,23.02 35.24,23.18 28.26,23.5 26.19,20.8 24.61,22.54 22.7,23.34 21.43,25.08 19.21,23.18 19.37,27.46 24.92,27.15 26.83,25.08 24.45,24.61 22.07,30 23.97,33.18 24.13,29.69 27.78,33.66 23.97,36.04 21.27,33.02 21.43,36.67 19.53,31.75 19.37,36.51 21.27,40.64 19.37,41.91 16.03,42.39 6.67,94.14 26.51,86.36 27.3,87.31 28.26,86.2 26.83,84.61 25.72,84.61 24.61,84.61 25.88,82.55 25.24,81.44 26.83,81.6 27.78,82.55 27.46,85.57 24.92,83.34 26.83,83.34 22.23,81.6 7.78,96.84 6.67,96.2 6.51,95.09 4.92,94.3 5.24,95.57 6.51,43.81 6.51,39.21 6.51,33.5 6.51,27.78 8.1,23.02 29.69,27.3 31.27,37.78 31.27,25.72 32.54,4.29 18.26,3.17 16.35,4.6 53.98,2.38 52.86,2.22 53.34,1.11 54.29,1.59 54.13,4.13 50.48,25.24 48.58,18.73 46.51,17.46 44.77,17.46 44.93,20.8 42.7,21.27 41.27,24.77 40.01,25.4 40.01,33.18 42.7,41.59 47.31,43.97 47.47,46.51 61.59,39.37 62.87,38.42 63.82,39.37 30.8,89.85 30,87.95 31.75,91.28 32.07,88.74 33.66,88.42 33.97,91.44 32.38,97 33.18,97.47 31.11,97.79 30.96,99.06 35.08,99.22 28.89,98.9 26.99,99.06 19.21,73.34 16.83,70.96 16.67,66.83 20.48,68.26 24.92,75.72 20.48,71.6 25.24,68.26 25.24,66.04 25.4,63.5 25.24,60.96 30.32,66.36 29.21,63.18 43.34,86.36 40.8,89.53 28.42,79.38 35.4,19.05 35.56,14.92 33.66,15.88 39.69,8.41 40.64,10 40.64,17.94 30.48,18.57 30.16,15.08 30.16,11.59
  pour Top: 0,100.33 71.12,100.33 71.12,0 0,0
  pour Bottom: 0,0 71.12,0 71.12,100.33 0,100.33
I1-  (via drill 0.33)
  Top 0.254: U1.5 9.53,92.71 9.84,93.03 11.11,93.03 11.43,93.34 11.43,95.25
  Top 0.406: v12.06,95.89 v11.11,95.89 v10.16,95.89 10.79,95.25 v10.79,94.93 v11.75,94.93 v12.7,94.93 12.12,95.51 R1.2 11.43,95.25
  Bottom 1.422: C5.1 10.11,95.28 | 10.11,95.28 11.18,92.14 | 11.18,92.14 L1.2 13.34,89.99 | 10.11,95.28 11.3,92.58 11.43,92.71 11.43,94.61 v11.75,94.93 | 10.79,89.22 10.79,85.72 10.16,85.09 C8.+ | 10.79,89.22 10.79,91.76 11.18,92.14 | C26.+ 10.48,88.9 10.79,89.22
I1-1  (via drill 0.33)
  Top 0.254: U8.5 62.55,92.39 62.23,92.71 61.59,92.71 61.28,93.03 60.01,93.03 59.69,93.34 59.69,95.25
  Top 0.406: R17.2 59.69,95.25 v60.01,94.93
  Bottom 0.406: L2.2 59.23,95.07 v58.42,95.89 58.42,95.57 v59.05,94.93 59.05,95.57 v59.37,95.89 59.37,95.57 v60.01,94.93 60.01,95.57 v60.33,95.89 60.33,95.57 v60.96,94.93
  Bottom 1.27: C20.1 60.38,92.58 L2.2 | 59.38,91.3 L2.2 | C21.+ 60.96,88.27 61.28,88.58 | 60.96,88.9 60.96,89.72 L2.2
  Bottom 1.422: C22.+ 61.28,88.58 60.96,88.9
IS1O
  Top 0.254: U1.6 9.05,94.44 R12.1
IS1O1
  Top 0.254: R24.1 63.5,91.61 U8.6
ISNS_REF  (via drill 0.33)
  Top 0.254: C11.1 U1.1 4.78,93.36 4.45,93.03 4.45,88.27 6.03,86.68 6.03,82.23 4.45,80.64 4.45,75.56 7.62,72.39 7.62,62.23 v8.89,60.96 | R10.2 33.64,48.26 R11.1 34.92,48.26 34.92,47.31 35.24,46.99 36.83,46.99 38.1,48.26 v38.1,60.96 39.37,62.23 41.91,62.23 | 41.91,62.23 MCU1.A5 v48.26,62.23 | C15.1 41.92,62.22 41.91,62.23 | U8.1 64.3,93.51 64.78,94 C16.1 | v65.72,94.61 C16.1 | C16.1 64.77,94.61
  Bottom 0.254: v8.89,60.96 21.59,60.96 24.13,58.42 35.56,58.42 v38.1,60.96 | v48.26,62.23 63.5,62.23 66.04,64.77 66.04,77.47 64.77,78.74 64.77,85.09 66.04,86.36 66.04,94.3 v65.72,94.61
N$1
  Top 0.406: MCU1.A8 R2.2
N$2
  Top 0.406: MCU1.A9 R3.2
N$3
  Bottom 0.254: R19.2 17.13,42.95 U4.1 16.26,43.18 R18.2
N$4
  Bottom 0.254: R20.2 16.26,45.72 U4.3 17.13,45.95 R21.1
N$5  (via drill 0.33)
  Top 0.406: v26.99,96.84 U3.5
  Bottom 0.406: Q2.1 26.35,96.83 v26.99,96.84
N$6
  Bottom 1.27: Q2.3 22.23,95.89 21.59,95.25 21.59,92.71 | 21.59,92.71 21.59,91.89 L1.1 | D2.A 21.59,92.71 | Q3.3 23.04,89.53 L1.1 | D1.K 22.86,86.36 21.59,87.63 21.59,91.44 L1.1
N$7  (via drill 0.33)
  Top 0.406: R4.2 28.17,90.19 U7.5 v26.99,90.49
  Bottom 0.406: v26.99,90.49 Q3.1
N$8
  Top 0.406: MCU1.A10 R5.2
N$9
  Top 0.406: R6.2 MCU1.A11
N$10
  Top 0.406: LED1.3 23.7,18.29 R16.1
N$11
  Top 0.406: LED1.1 27.1,18.29 R15.1
N$12
  Top 0.406: LED1.2 R14.1
N$13
  Bottom 1.422: J1.2 38.02,95.33 36.68,96.67 R22.1
N$14
  Top 0.254: Q1.1 18.45,1.93 D5.K D7.K 22.26,1.93 R23.2
N$15
  Top 0.254: R36.2 48.86,1.93 D8.K D6.K 51.44,2.58 Q6.1
N$16
  Bottom 0.254: R26.2 54.86,45.72 U9.1 53.99,45.95 R27.2
N$17
  Bottom 0.254: R28.2 54.86,43.18 U9.3 53.99,42.95 R29.1
N$18
  Bottom 1.27: D4.A 48.72,92.71 49.12,92.3 | 49.12,92.3 L2.1 48.08,89.53 | Q4.3 48.9,95.89 49.53,95.25 49.53,92.71 49.12,92.3 | Q5.3 48.08,89.53 | D3.K 48.26,86.36 49.53,87.63 49.53,88.08 48.08,89.53
N$19  (via drill 0.33)
  Top 0.406: U10.5 44.13,88.58 v43.81,88.58
  Bottom 0.406: v43.81,88.58 Q5.1
N$20  (via drill 0.33)
  Top 0.406: v44.13,94.93 v44.13,94.94 U11.5 42.91,94.6 R30.2
  Bottom 0.406: v44.13,94.93 Q4.1
N$21
  Top 0.406: LED2.3 44.02,18.29 R35.1
N$22
  Top 0.406: LED2.1 47.42,18.29 R34.1
N$23
  Top 0.406: LED2.2 R33.1
N$27  (via drill 0.33)
  Top 0.254: U12.7 36.2,11.59 v36.51,11.91
  Bottom 0.254: v36.51,11.91 JP3.2
N$28  (via drill 0.33)
  Top 0.254: U12.6 34.92,11.75 v35.08,11.91
  Bottom 0.254: JP4.2 v35.08,11.91
N$29  (via drill 0.33)  (2 unrouted)
  Top 0.254: U12.5 JP5.2
  Bottom 0.254: JP5.2 33.66,10.95 | 35.24,11.91 35.24,10.95 | 36.83,11.91 36.83,10.95
  other vias: 33.66,11.91
R1  (via drill 0.33)
  Top 0.406: MCU1.B4 28.26,49.53 28.89,48.9 v28.89,45.72 | R14.2 25.4,22.23 28.89,25.72 v28.89,41.91
  Bottom 0.406: v28.89,45.72 v28.89,41.91
R2  (via drill 0.33)
  Top 0.406: v45.72,23.5 R33.2
  Bottom 0.406: MCU1.B9 44.13,41.91 42.55,40.32 42.55,26.67 v45.72,23.5
RX  (via drill 0.33)
  Top 0.254: MCU1.B11 53.34,77.47 54.61,76.2 54.61,52.07 v54.93,51.75
  Bottom 0.254: JP1.3 JP2.1 48.58,7.62 52.39,11.43 60.64,11.43 64.14,14.92 64.14,37.47 64.45,37.78 64.45,39.69 64.14,40.01 64.14,48.9 61.28,51.75 v54.93,51.75
S1  (via drill 0.33)
  Top 0.254: MCU1.B12 25.4,77.47 17.78,69.85 17.78,54.61 15.24,52.07 v13.34,52.07 | v10.16,52.07 7.94,52.07 7.46,51.59 7.46,24.61 8.1,23.97 v10.32,23.97 | S1.2 v23.5,25.24 S1.1
  Bottom 0.254: v13.34,52.07 v10.16,52.07 | v10.32,23.97 22.23,23.97 v23.5,25.24
S2  (via drill 0.33)
  Top 0.254: MCU1.B13 24.77,74.93 19.05,69.22 19.05,63.82 20.32,62.55 20.32,55.24 18.26,53.18 17.62,53.18 13.97,49.53 v13.18,49.53 | v9.84,49.53 9.84,45.09 9.21,44.45 9.21,43.18 9.68,42.7 9.68,29.05 v10.16,28.57 | v21.91,28.57 v27.46,28.57 | v31.91,23.97 41.75,23.97 43.81,21.91 S2.1 S2.2
  Bottom 0.254: v13.18,49.53 v9.84,49.53 | v10.16,28.57 v21.91,28.57 | v27.46,28.57 27.46,28.42 v31.91,23.97
SCL
  Top 0.254: U12.2 36.2,20.95 LCD1.3=SCL
  Bottom 0.254: MCU1.B6 25.72,44.45 25.08,43.81 25.08,35.56 23.18,33.66 23.18,27.3 28.57,21.91 28.57,20.32 29.53,19.37 34.61,19.37 LCD1.3=SCL
SDA
  Top 0.254: U12.1 37.47,19.68 LCD1.4-SDA
  Bottom 0.254: LCD1.4-SDA 39.37,39.37 38.1,40.64 27.94,40.64 MCU1.B7
TX  (via drill 0.33)
  Top 0.254: MCU1.B10 46.99,74.93 48.26,73.66 48.26,66.67 v47.62,66.04 | v49.53,11.11 47.94,9.53 47.94,6.35 46.67,5.08 JP2.2
  Bottom 0.254: JP2.2 JP1.2 | v49.53,11.11 50.8,12.38 59.37,12.38 63.18,16.19 63.18,37.78 63.5,38.1 63.5,38.73 63.18,39.05 63.18,47.94 60.64,50.48 54.29,50.48 53.66,51.12 53.66,52.39 53.98,52.7 53.98,60.64 53.66,60.96 47.62,60.96 46.99,61.59 46.99,65.41 v47.62,66.04

### Text on the board
tPlace: 1u | 1u | 100 | 1u | 1u | 1u | 10m | 10m | 100 | 10k | 20k | 1u | 1u | 1u | 1u | 1u | + | + | 0 | 0 | 0 | 0 | 1u | 0 | 1u | 2k2 | TL431 | 8k2 | 16k | NTC10k | 10k | 10k | NTC10k | B1 | B2 | GND | 3V3 | SCL | SDA | 22 | 75 | 22 | 22 | 75 | 22 | 1u | RX | RX | NFET | 100k | TX | TX | 100k | NFET | 10k | 10k | GND | GND | 10k | 10k
bPlace: GND | VBAT | PFET | NFET | 5A | NFET | PFET | rev0.net | 150k | 150k | 220k | 220k | 1u | 1u | 220k | 220k | 150k | 150k | justin kenny 2018 | Def. Addr. | 0x48
bStop: regenerative 18650 cycler | v1.0